# Altium schematic sheet TrabajoTecnologiaCarlos.SchDoc
size A4
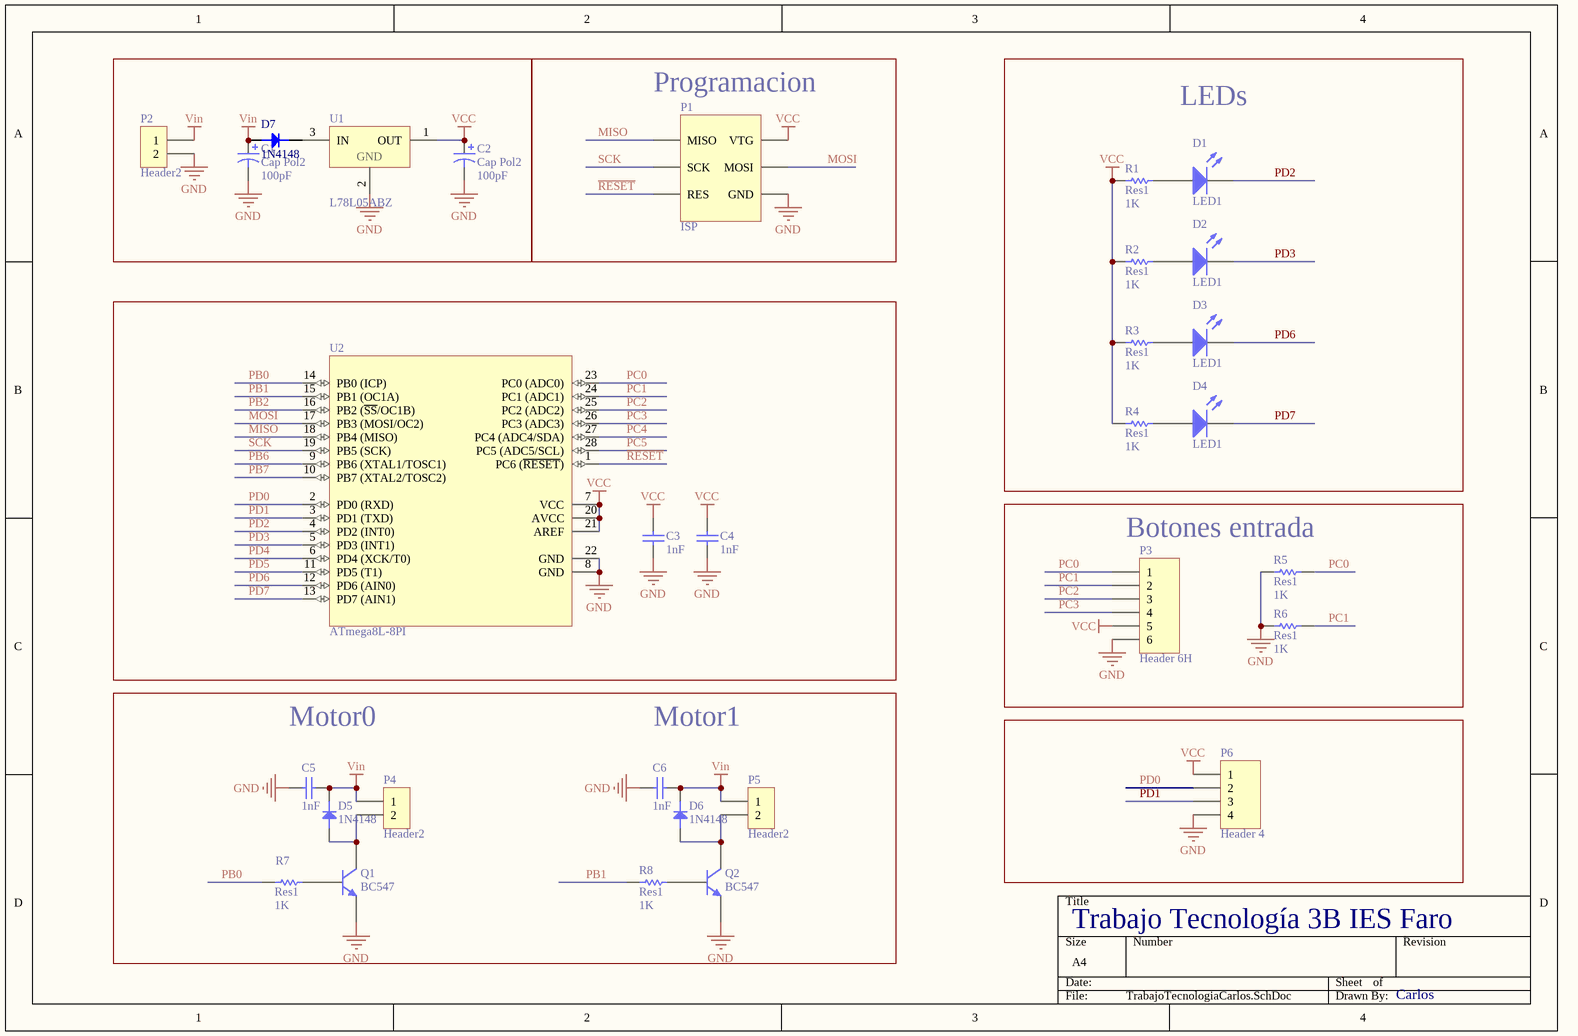
[diagram p0: TrabajoTecnologiaCarlos.SchDoc]

## Parts
C1  Cap Pol2  value 100pF  [TC7360-2924]
C2  Cap Pol2  value 100pF  [TC7360-2924]
C3  value 1nF  [0805_CAP]  (hidden comment: Capacitor)
C4  value 1nF  [0805_CAP]  (hidden comment: Capacitor)
C5  value 1nF  [0805_CAP]  (hidden comment: Capacitor)
C6  value 1nF  [0805_CAP]  (hidden comment: Capacitor)
D1  LED1  [LED-1]
D2  LED1  [LED-1]
D3  LED1  [LED-1]
D4  LED1  [LED-1]
D5  1N4148  [1N4148SMD]
D6  1N4148  [1N4148SMD]
D7  1N4148  [1N4148SMD]
P1  ISP  [AVR_ISP]
P2  Header2  [Header2Macho]
P3  Header 6H  [HDR1X6H]
P4  Header2  [Header2Macho]
P5  Header2  [Header2Macho]
P6  Header 4  [HDR1X4]
Q1  BC547  [TO92]
Q2  BC547  [TO92]
R1  Res1  value 1K  [AXIAL-0.3 3D]
R2  Res1  value 1K  [AXIAL-0.3 3D]
R3  Res1  value 1K  [AXIAL-0.3 3D]
R4  Res1  value 1K  [AXIAL-0.3 3D]
R5  Res1  value 1K  [AXIAL-0.3 3D]
R6  Res1  value 1K  [AXIAL-0.3 3D]
R7  Res1  value 1K  [AXIAL-0.3 3D]
R8  Res1  value 1K  [AXIAL-0.3 3D]
U1  L78L05ABZ  [TO92V2]
U2  ATmega8L-8PI  [28P3]

## Blocks framed on the sheet
Programacion: P1
LEDs: D1-D4 R1-R4
Botones entrada: P3 R5 R6

## Nets
GND: C1.2 C2.2 C3.1 C4.1 C5.2 C6.2 P1.5(GND) P2.2 P3.6 P6.4 Q1.1(E) Q2.1(E) R5.2 R6.2 U1.2(GND) U2.8(GND) U2.22(GND)
VCC: C2.1 C3.2 C4.2 P1.1(VTG) P3.5 P6.1 R1.1 R2.1 R3.1 R4.1 U1.1(OUT) U2.7(VCC) U2.20(AVCC) U2.21(AREF)
Vin: C1.1 C5.1 C6.1 D5.2(K) D6.2(K) D7.1(A) P2.1 P4.1 P5.1
MISO: P1.0(MISO) U2.18(PB4_(MISO))
MOSI: P1.3(MOSI) U2.17(PB3_(MOSI/OC2))
PB0: R7.1 U2.14(PB0_(ICP))
PB1: R8.1 U2.15(PB1_(OC1A))
PB2: U2.16(PB2_(~{SS}/OC1B))
PB6: U2.9(PB6_(XTAL1/TOSC1))
PB7: U2.10(PB7_(XTAL2/TOSC2))
PC0: P3.1 R5.1 U2.23(PC0_(ADC0))
PC1: P3.2 R6.1 U2.24(PC1_(ADC1))
PC2: P3.3 U2.25(PC2_(ADC2))
PC3: P3.4 U2.26(PC3_(ADC3))
PC4: U2.27(PC4_(ADC4/SDA))
PC5: U2.28(PC5_(ADC5/SCL))
PD0: P6.2 U2.2(PD0_(RXD))
PD1: P6.3 U2.3(PD1_(TXD))
PD2: D1.2(K) U2.4(PD2_(INT0))
PD3: D2.2(K) U2.5(PD3_(INT1))
PD4: U2.6(PD4_(XCK/T0))
PD5: U2.11(PD5_(T1))
PD6: D3.2(K) U2.12(PD6_(AIN0))
PD7: D4.2(K) U2.13(PD7_(AIN1))
~{RESET}: P1.4(RES) U2.1(PC6_(~{RESET}))
SCK: P1.2(SCK) U2.19(PB5_(SCK))
NetD1_1: D1.1(A) R1.2
NetD2_1: D2.1(A) R2.2
NetD3_1: D3.1(A) R3.2
NetD4_1: D4.1(A) R4.2
NetD5_1: D5.1(A) P4.2 Q1.3(C)
NetD6_1: D6.1(A) P5.2 Q2.3(C)
NetD7_2: D7.2(K) U1.3(IN)
NetQ1_2: Q1.2(B) R7.2
NetQ2_2: Q2.2(B) R8.2

## Notes on the sheet
- Motor0
- Motor1
- Trabajo Tecnología 3B IES Faro
- Carlos

## Library data of the parts
C1 C2 = Cap Pol2: Polarized Capacitor (Axial); Published: 8-Jun-2000; LatestRevisionDate: 17-Jul-2002; LatestRevisionNote: Re-released for DXP Platform.; PackageReference: POLAR0.8; Publisher: Altium Limited
C3-C6 = Cap
D1-D4 = LED1: Typical RED GaAs LED; Published: 8-Jun-2000; LatestRevisionDate: 08-Jul-2005; LatestRevisionNote: Mech Layer 1 removed.; PackageReference: LED-1; Publisher: Altium Limited; PackageDescription: LED; 2 Leads
P1 = AVR_ISP
P3 = Header 6H: Header, 6-Pin, Right Angle; LatestRevisionDate: 17-Jul-2002; LatestRevisionNote: Re-released for DXP Platform.; Publisher: Altium Limited
P6 = Header 4: Header, 4-Pin; LatestRevisionDate: 17-Jul-2002; LatestRevisionNote: Re-released for DXP Platform.; Publisher: Altium Limited
R1-R8 = Res1: Resistor; Published: 8-Jun-2000; LatestRevisionDate: 17-Jul-2002; LatestRevisionNote: Re-released for DXP Platform.; PackageReference: AXIAL-0.3; Publisher: Altium Limited
U1 = L78L05ABZ: Positive Voltage Regulator; Published: 24-Aug-2001; LatestRevisionDate: 17-Jul-2002; LatestRevisionNote: Re-released for DXP Platform.; DatasheetVersion: Feb-1999; PackageReference: TO92; Publisher: Altium Limited; PackageDescription: TO, Flat Index; 3 In-Line, Axial Leads; Body Dia. 4.8mm; Leads 0.51 x 0.51 mm (max); ComponentLink1Description: Manufacturer Link; ComponentLink1URL: http://www.st.com/
U2 = ATmega8L-8PI: 8-Bit AVR Microcontroller with 8K Bytes of In-System Programmable Flash Memory; Published: 17-Sep-2003; LatestRevisionDate: 04-Mar-2005; LatestRevisionNote: Stylized 3D Model Added.; DatasheetVersion: 2486H-AVR-09/02; PackageVersion: revB, Sep-2001; PackageReference: 28P3; Publisher: Altium Limited; PackageDescription: DIP; 28 Leads; Row Spacing 7.62 mm; Pitch 2.54 mm; ComponentLink1Description: Manufacturer Link; ComponentLink1URL: http://www.atmel.com; ComponentLink2Description: Datasheet; ComponentLink2URL: http://www.atmel.com/dyn/resources/prod_documents/doc2486.pdf